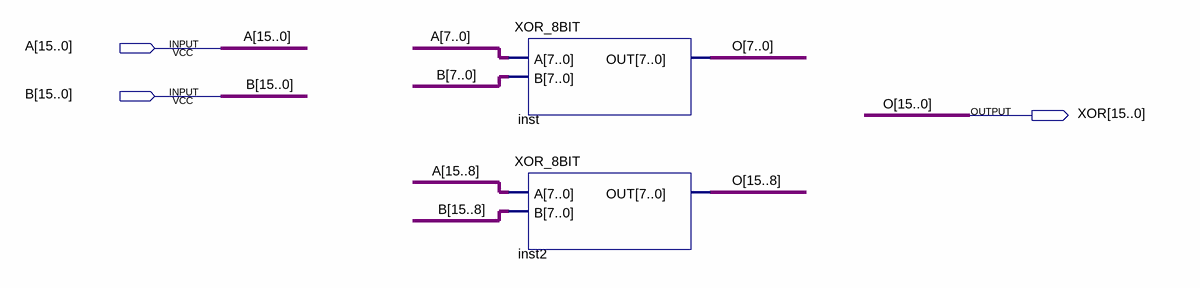
[diagram p0: schematic sheet]
// Quartus schematic XOR_16BIT.bdf as structural Verilog: 2 symbols, 3 pins
module XOR_16BIT (
  input  [15:0] A,
  input  [15:0] B,
  output [15:0] XOR
);

  XOR_8BIT inst (.A(A[7:0]), .B(B[7:0]), .OUT(XOR[7:0]));
  XOR_8BIT inst2 (.A(A[15:8]), .B(B[15:8]), .OUT(XOR[15:8]));

  // Other names for the same wires on the sheet: O[15:0] = XOR
endmodule
